# EAGLE design Screen PCB (EAGLE 9.6.2)
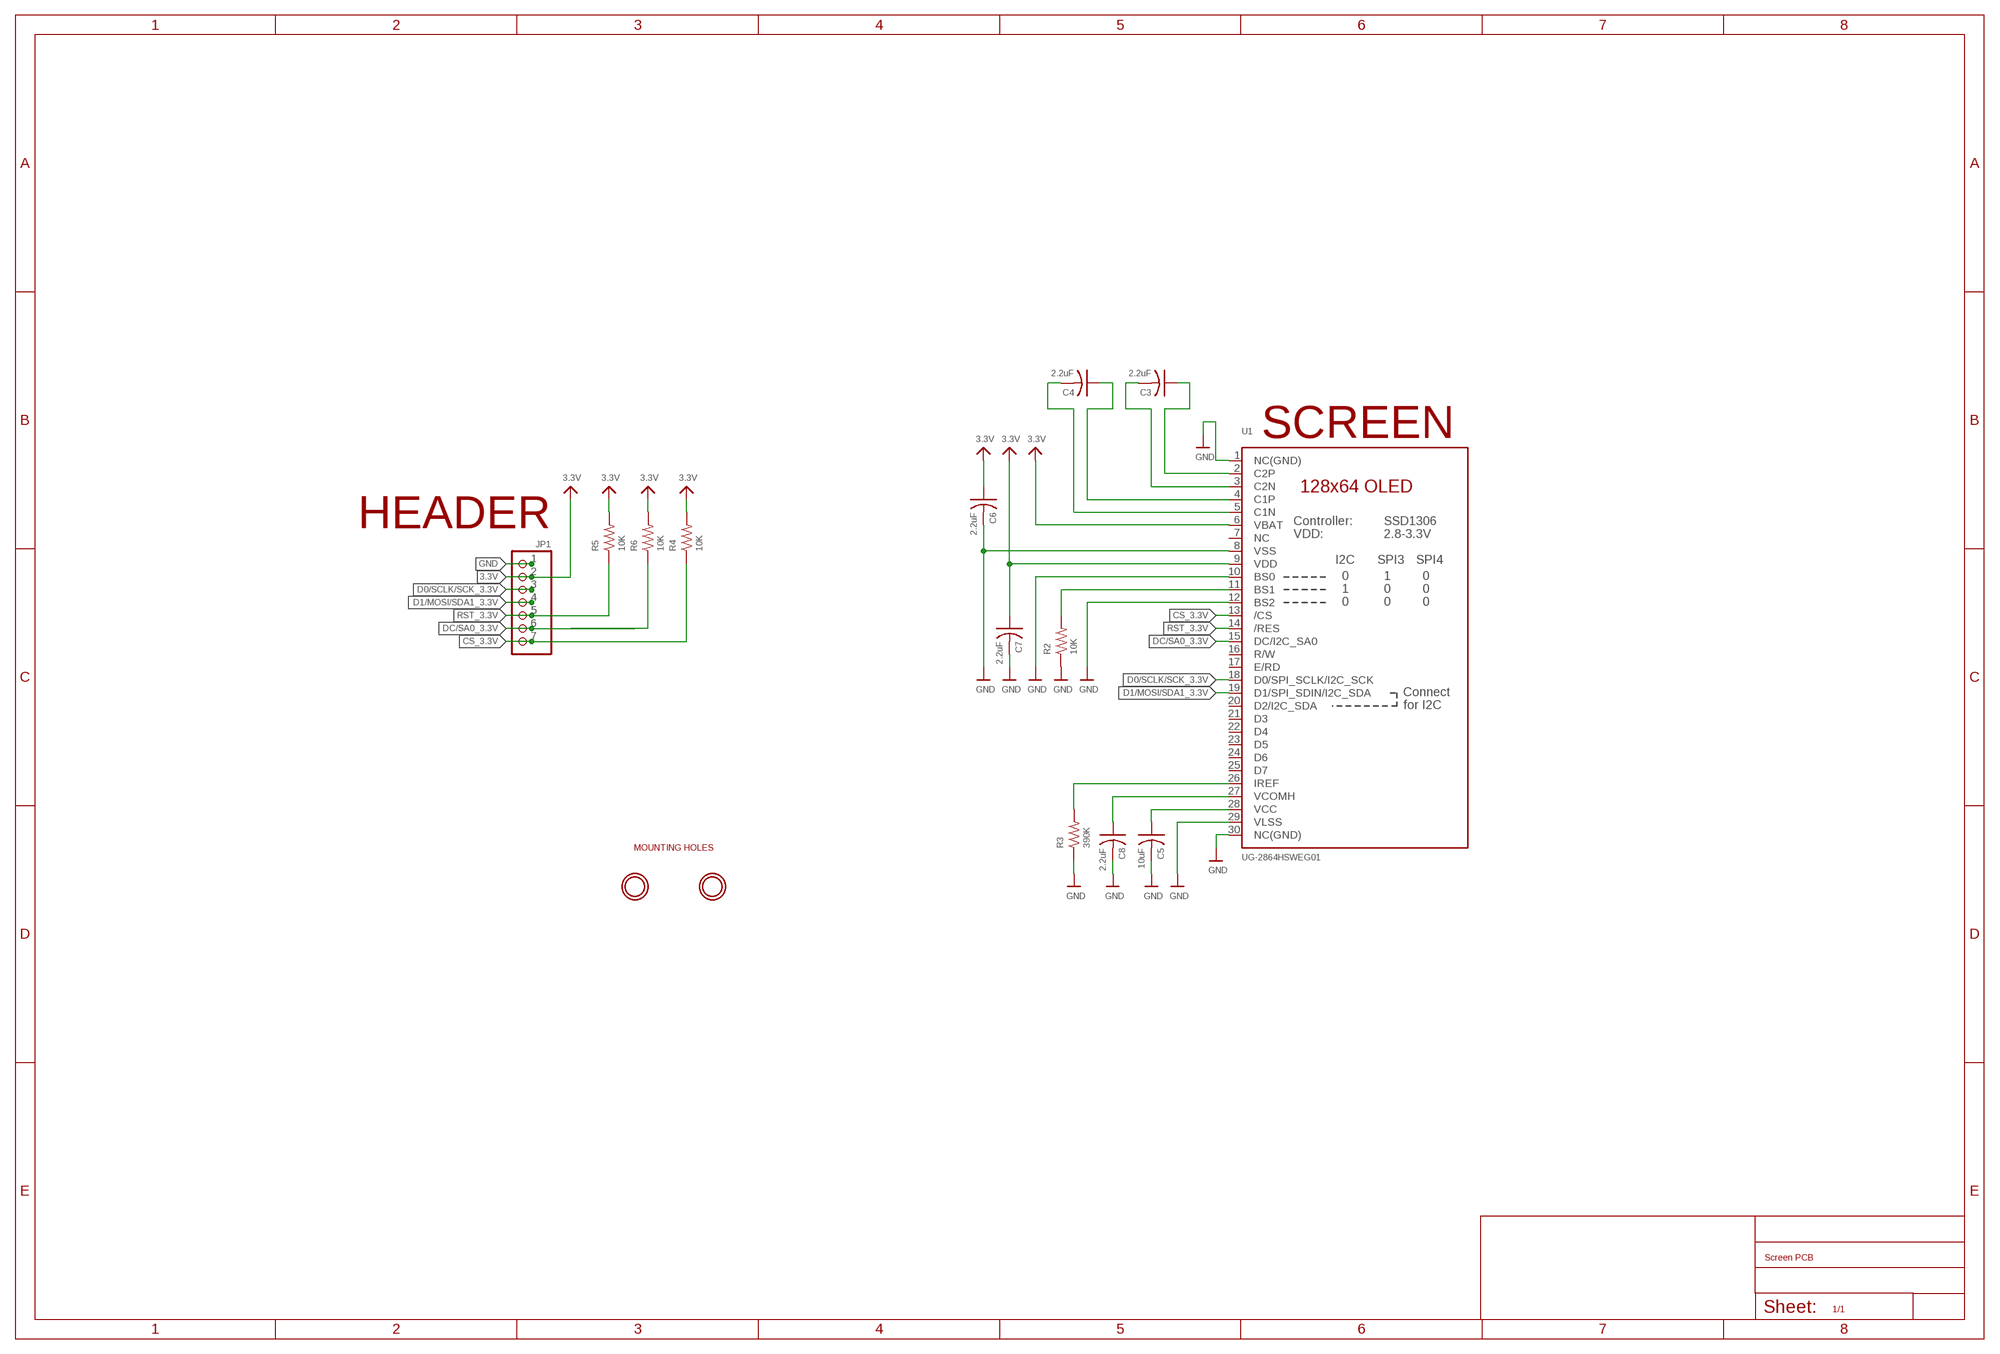
[diagram p0: schematic, sheet 1]

## Parts
C3  2.2uF  C-USC0805  [C0805]
C4  2.2uF  C-USC0805  [C0805]
C5  10uF  C-USC0805  [C0805]
C6  2.2uF  C-USC0805  [C0805]
C7  2.2uF  C-USC0805  [C0805]
C8  2.2uF  C-USC0805  [C0805]
JP1  HEADER-1X7ROUND  [1X07_ROUND]
R2  10K  R-US_R0805  [R0805]
R3  390K  R-US_R0805  [R0805]
R4  10K  R-US_R0805  [R0805]
R5  10K  R-US_R0805  [R0805]
R6  10K  R-US_R0805  [R0805]
U1  UG-2864HSWEG01  DISP_OLED_UG-2864HSWEG01  [UG-2864HSWEG01_1.3_WRAPAROUND]
U$23  MOUNTINGHOLE2.5  [MOUNTINGHOLE_2.5_PLATED]
U$26  MOUNTINGHOLE2.5  [MOUNTINGHOLE_2.5_PLATED]

## Nets
3.3V: C6.1 C7.1 JP1.2 R4.2 R5.2 R6.2 U1.6(VBAT) U1.9(VDD)
CS_3.3V: JP1.7 R4.1 U1.13(/CS)
D0/SCLK/SCK_3.3V: JP1.3 U1.18(D0/SPI_SCLK/I2C_SCK)
D1/MOSI/SDA1_3.3V: JP1.4 U1.19(D1/SPI_SDIN/I2C_SDA)
DC/SA0_3.3V: JP1.6 R6.1 U1.15(DC/I2C_SA0)
GND: C5.2 C6.2 C7.2 C8.2 JP1.1 R2.1 R3.1 U1.1(NC(GND)) U1.8(VSS) U1.10(BS0) U1.12(BS2) U1.29(VLSS) U1.30(NC(GND))
N$1: R2.2 U1.11(BS1)
N$3: R3.2 U1.26(IREF)
N$4: C4.1 U1.4(C1P)
N$5: C3.2 U1.3(C2N)
N$6: C3.1 U1.2(C2P)
N$7: C4.2 U1.5(C1N)
N$11: C5.1 U1.28(VCC)
N$12: C8.1 U1.27(VCOMH)
RST_3.3V: JP1.5 R5.1 U1.14(/RES)
Unconnected: U1.7(NC) U1.16(R/W) U1.17(E/RD) U1.20(D2/I2C_SDA) U1.21(D3) U1.22(D4) U1.23(D5) U1.24(D6) U1.25(D7)

## Notes on the sheet
- SCREEN
- HEADER
- MOUNTING HOLES

## Library data of the parts
C3-C8 = dk lib:C-US: CAPACITOR, American symbol; SPICEPREFIX: C
JP1 = microbuilder:HEADER-1X7: PIN HEADER
R2-R6 = dk lib:R-US_: RESISTOR, American symbol; SPICEPREFIX: R
U1 = microbuilder:DISP_OLED_UG-2864HSWEG01: UG-2864HSWEG01 OLED display Both 1.3" and 0.96" models share the same FPC tab footprint, only the screen dimensions vary.
U$23 U$26 = microbuilder:MOUNTINGHOLE: Mounting Hole For #2 screws (0.086"/2.18mm width, 0.094"/2.4mm hole) use 2.5mm

## Board
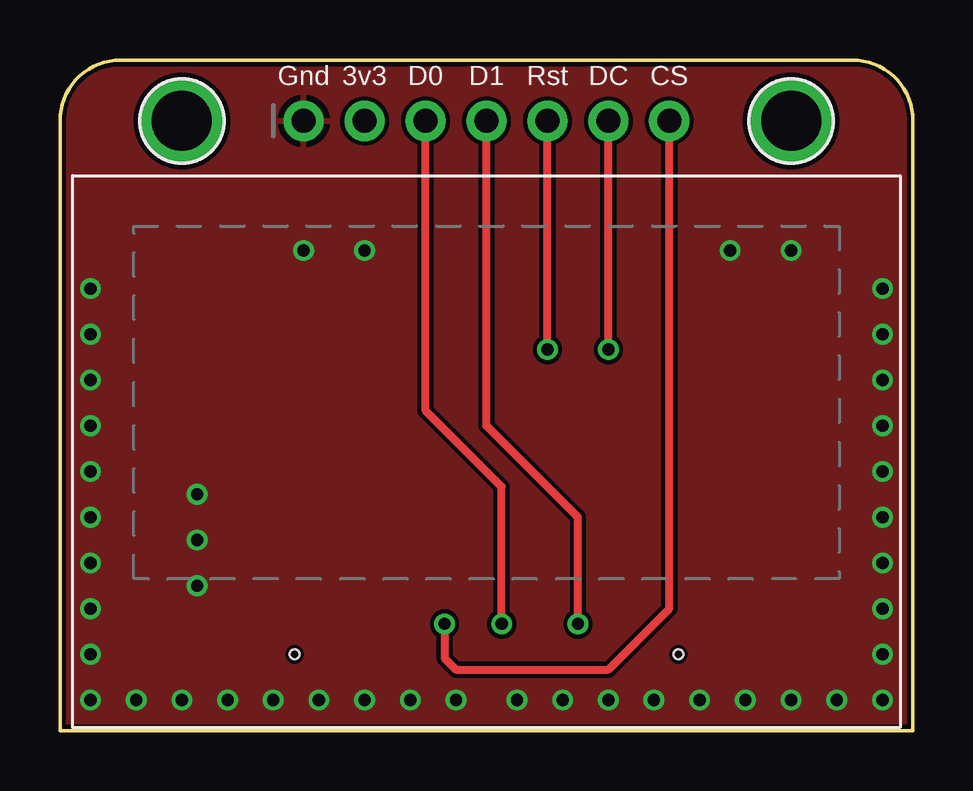
[diagram p1: board, top side]
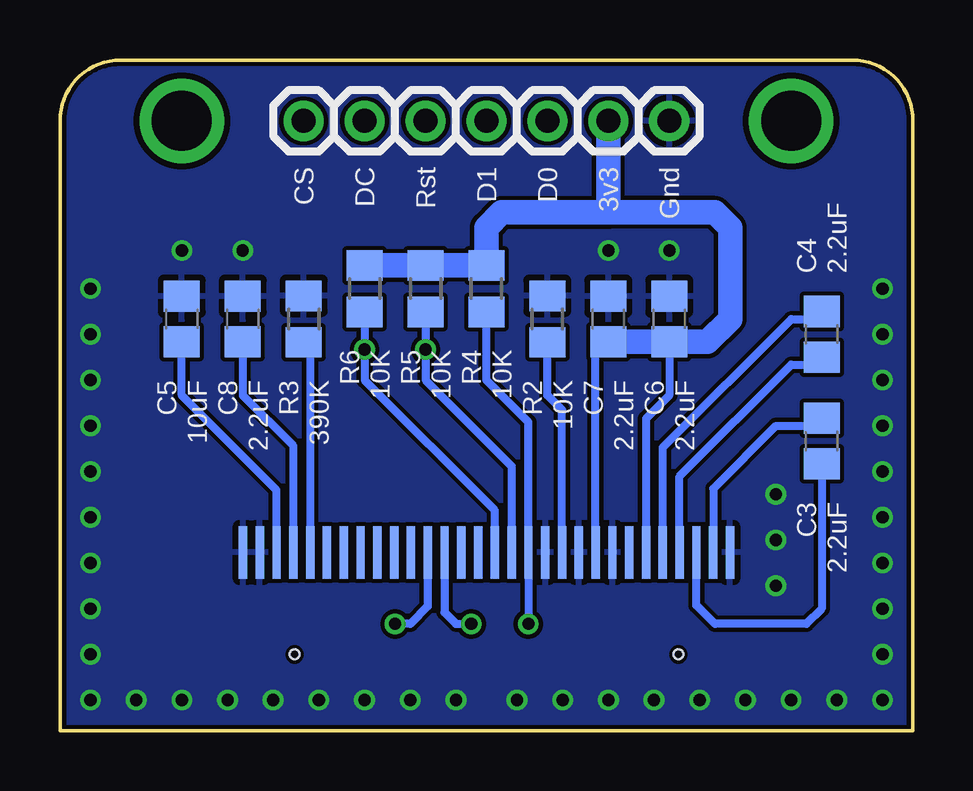
[diagram p2: board, bottom side, seen from below]

Size 35.56 x 27.94 mm. Coordinates in mm from the lower left corner, seen from the top.
Outline: 0,0 0,25.4 arc-90 2.54,27.94 33.02,27.94 arc-90 35.56,25.4 35.56,0 0,0
Copper layers (1*16): Top 0.035mm / dielectric 1.5mm / Bottom 0.035mm
Design rules "SparkFun-2-layer-TIGHT": minimum track width 7mil, minimum drill 15mil, track to track 7mil, track to pad 7mil, pad to pad 7mil, via to via 7mil, smd to smd 7mil, copper to edge 7mil, drill to drill 7mil, minimum pad ring 7mil, minimum via ring 7mil, stop-mask expansion 4mil, vias tented up to drill 25mil, thermal gap 10mil

### Footprints (pad centres in the part's own frame; a part is rotated, then mirrored left to right if it is on the bottom)
C0805 = smd 1.3 x 1.5: 1 -0.95,0; 2 0.95,0
1X07_ROUND = drill 1 pad 1.676: 1 -7.62,0; 2 -5.08,0; 3 -2.54,0; 4 0,0; 5 2.54,0; 6 5.08,0; 7 7.62,0
R0805 = smd 1.27 x 1.5: 1 -0.965,0; 2 0.965,0
UG-2864HSWEG01_1.3_WRAPAROUND = smd 0.35 x 2.2 bottom: 1 -10.15,-0.2; 2 -9.45,-0.2; 3 -8.75,-0.2; 4 -8.05,-0.2; 5 -7.35,-0.2; 6 -6.65,-0.2; 7 -5.95,-0.2; 8 -5.25,-0.2; 9 -4.55,-0.2; 10 -3.85,-0.2; 11 -3.15,-0.2; 12 -2.45,-0.2; 13 -1.75,-0.2; 14 -1.05,-0.2; 15 -0.35,-0.2; 16 0.35,-0.2; 17 1.05,-0.2; 18 1.75,-0.2; 19 2.45,-0.2; 20 3.15,-0.2; 21 3.85,-0.2; 22 4.55,-0.2; 23 5.25,-0.2; 24 5.95,-0.2; 25 6.65,-0.2; 26 7.35,-0.2; 27 8.05,-0.2; 28 8.75,-0.2; 29 9.45,-0.2; 30 10.15,-0.2 | hole 0.4: -8,-4.45; 8,-4.45
MOUNTINGHOLE_2.5_PLATED = drill 2.5 pad 3.2: P$1 0,0

### Placement (x,y rotation side)
C3  3.81,12.06 270 bottom
C4  3.81,16.51 90 bottom
C5  30.48,17.14 90 bottom
C6  10.16,17.14 90 bottom
C7  12.7,17.14 90 bottom
C8  27.94,17.14 90 bottom
JP1  17.78,25.4 0 top
R2  15.24,17.14 270 bottom
R3  25.4,17.14 270 bottom
R4  17.78,18.41 90 bottom
R5  20.32,18.41 90 bottom
R6  22.86,18.41 90 bottom
U1  17.78,7.62 0 top
U$23  30.48,25.4 0 top
U$26  5.08,25.4 0 top

### Tracks (layer width: path | path; a pad name or v marks a point on that pad's centre or on a via)
3.3V
  Bottom 0.33: U1.9 13.23,15.66 C7.1 | C6.1 10.16,13.97 11.13,13 U1.6
  Bottom 1.016: 12.7,21.59 8.26,21.59 7.62,20.95 7.62,17.14 8.57,16.2 C6.1 C7.1 | 12.7,21.59 JP1.2 | 12.7,21.59 17.14,21.59 17.78,20.95 R4.2 R5.2 R6.2
CS_3.3V  (via drill 0.51)
  Top 0.33: v16.03,4.44 16.03,3.02 16.51,2.54 22.86,2.54 25.4,5.08 JP1.7
  Bottom 0.33: v16.03,4.44 v16.03,4.45 U1.13 16.03,12.86 17.78,14.61 R4.1
D0/SCLK/SCK_3.3V  (via drill 0.51)
  Top 0.33: v18.41,4.44 18.41,10.16 15.24,13.33 JP1.3
  Bottom 0.33: U1.18 19.53,4.92 19.05,4.44 v18.41,4.44
D1/MOSI/SDA1_3.3V  (via drill 0.51)
  Top 0.33: v21.59,4.44 21.59,8.89 17.78,12.7 JP1.4
  Bottom 0.33: U1.19 20.23,5.17 20.95,4.44 v21.59,4.44
DC/SA0_3.3V  (via drill 0.51)
  Top 0.33: v22.86,15.88 JP1.6
  Bottom 0.33: U1.15 17.43,9.18 22.86,14.61 v22.86,15.88 R6.1
GND  (via drill 0.51)
  other vias: 10.16,20 12.7,20 27.94,20 30.48,20 5.71,6.03 5.71,7.94 5.71,9.84 1.27,1.27 3.17,1.27 5.08,1.27 6.99,1.27 8.89,1.27 10.79,1.27 12.7,1.27 14.61,1.27 16.51,1.27 19.05,1.27 20.95,1.27 22.86,1.27 24.77,1.27 26.67,1.27 28.57,1.27 30.48,1.27 32.38,1.27 34.29,1.27 34.29,3.17 34.29,5.08 34.29,6.99 34.29,8.89 34.29,10.79 34.29,12.7 34.29,14.61 34.29,16.51 34.29,18.41 1.27,3.17 1.27,5.08 1.27,6.99 1.27,8.89 1.27,10.79 1.27,12.7 1.27,14.61 1.27,16.51 1.27,18.41
  pour Bottom: 0,0 35.56,0 35.56,27.94 0,27.94
  pour Top: 35.56,0 0,0 0,27.94 35.56,27.94
N$1
  Bottom 0.33: U1.11 14.63,13.36 15.24,13.97 R2.2
N$3
  Bottom 0.33: R3.2 25.13,15.91 U1.26
N$4
  Bottom 0.33: U1.4 9.73,10.59 5.08,15.24 4.13,15.24 C4.1
N$5
  Bottom 0.33: C3.2 3.81,5.08 4.45,4.44 8.26,4.44 9.03,5.22 U1.3
N$6
  Bottom 0.33: C3.1 4.12,12.7 5.71,12.7 8.33,10.08 U1.2
N$7
  Bottom 0.33: C4.2 4.12,17.14 5.08,17.14 10.43,11.79 U1.5
N$11
  Bottom 0.33: U1.28 26.53,10.02 30.48,13.97 C5.1
N$12
  Bottom 0.33: C8.1 27.94,13.97 25.83,11.86 U1.27
RST_3.3V  (via drill 0.51)
  Top 0.33: v20.32,15.88 JP1.5
  Bottom 0.33: U1.14 16.73,11.02 20.32,14.61 v20.32,15.88 R5.1

### Text on the board
tNames: Gnd | 3v3 | D0 | D1 | Rst | DC | CS
bNames: Gnd | 3v3 | D0 | D1 | Rst | DC | CS